# Altium schematic sheet AIR Control Relays.SchDoc
size A4
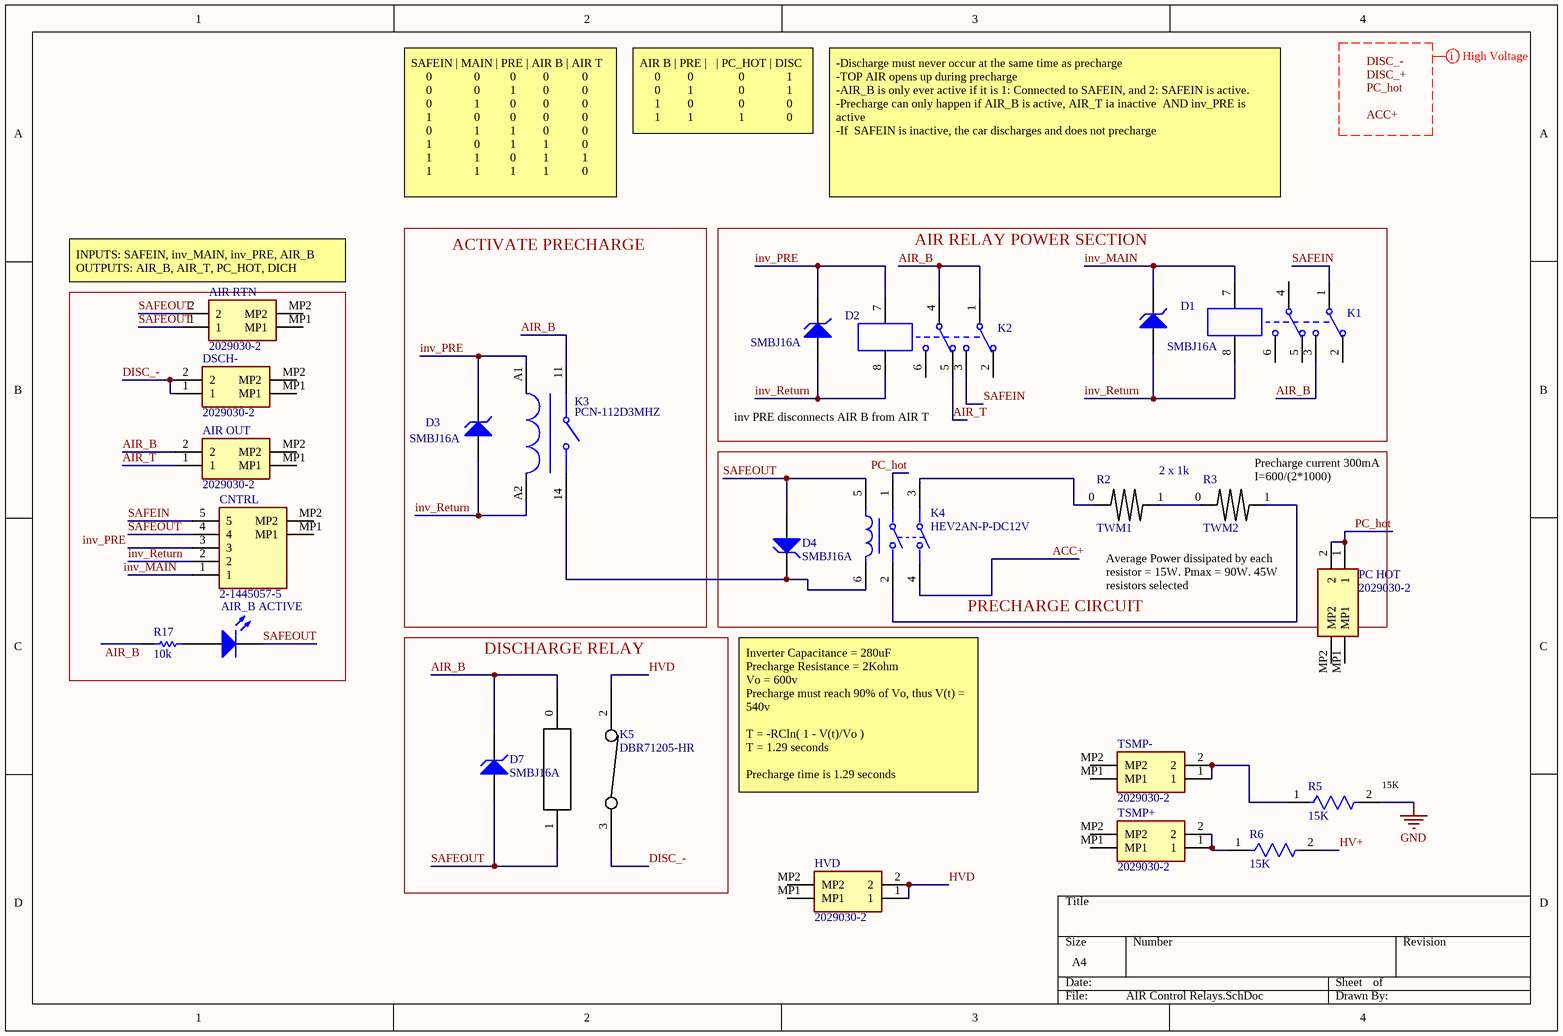
[diagram p0: AIR Control Relays.SchDoc]

## Parts
AIR_B_ACTIVE  HSMS-C177  [Led 0805/2012]  (value not drawn)
AIR_OUT  2029030-2  [20290302]
AIR_RTN  2029030-2  [20290302]
CNTRL  2-1445057-5  [214450575]
D1  SMBJ16A  [DO-214AA]
D2  SMBJ16A  [DO-214AA]
D3  SMBJ16A  [DO-214AA]
D4  SMBJ16A  [DO-214AA]
D7  SMBJ16A  [DO-214AA]
DSCH-  2029030-2  [20290302]
HVD  2029030-2  [20290302]
K1  Relay-DPDT  [S4190D]  (value not drawn)
K2  Relay-DPDT  [S4190D]  (value not drawn)
K3  PCN-112D3MHZ  [PCN-112D3MHZ]
K4  HEV2AN-P-DC12V  [FP-HE-V-MFG]
K5  DBR71205-HR  [RelaySPSTNC]
PC_HOT  2029030-2  [20290302]
R2  TWM1  [TWM20]
R3  TWM2  [TWM20]
R5  15K  [FP-SMF5-MFG]
R6  15K  [FP-SMF5-MFG]
R17  value 10k  [RES 0603/1608]  (hidden comment: RT0603BRC0710KL)
TSMP+  2029030-2  [20290302]
TSMP-  2029030-2  [20290302]

## Blocks framed on the sheet
ACTIVATE PRECHARGE: D3 K3
AIR RELAY POWER SECTION: D1 D2 K1 K2
PRECHARGE CIRCUIT: D4 K4 PC_HOT R2 R3
DISCHARGE RELAY: D7 K5

## Nets
GND: R5.2
ACC+: K4.4
AIR_B: AIR_OUT.2 D7.2(K) K1.3 K2.1 K2.4 K3.11 K5.0 R17.1
AIR_T: AIR_OUT.1 K2.5
DISC_-: DSCH-.1 DSCH-.2 K5.3
HV+: R6.2
HVD: HVD.1 HVD.2 K5.2
inv_MAIN: CNTRL.1 D1.2(K) K1.7
inv_PRE: CNTRL.3 D2.2(K) D3.2(K) K2.7 K3.A1
inv_Return: CNTRL.2 D1.1(A) D2.1(A) D3.1(A) K1.8 K2.8 K3.A2
PC_hot: K4.1 PC_HOT.1 PC_HOT.2
SAFEIN: CNTRL.5 K1.1 K2.3
SAFEOUT: AIR_B_ACTIVE.2(K) AIR_RTN.1 AIR_RTN.2 CNTRL.4 D4.1(A) D7.1(A) K4.5 K5.1
NetAIR_B_ACTIVE_1: AIR_B_ACTIVE.1(A) R17.2
NetD4_2: D4.2(K) K3.14 K4.6
NetK4_2: K4.2 R3.1
NetK4_3: K4.3 R2.0
NetR2_1: R2.1 R3.0
NetR5_1: R5.1 TSMP-.1 TSMP-.2
NetR6_1: R6.1 TSMP+.1 TSMP+.2

Not connected (* = marked no-connect by the designer): AIR_OUT MP1 MP2; AIR_RTN MP1 MP2; CNTRL MP1 MP2; DSCH- MP1 MP2; HVD MP1 MP2; K1 2 4 5 6; K2 2 6; PC_HOT MP1 MP2; TSMP+ MP1 MP2; TSMP- MP1 MP2

## Layout directives
net class High Voltage: ACC+, DISC_+, DISC_-, PC_hot

## Notes on the sheet
- AIR B | PRE |   | PC_HOT | DISC
  0         0               0              1
  0         1               0              1
  1         0               0              0
  1         1               1              0
- SAFEIN | MAIN | PRE | AIR B | AIR T
  0              0          0         0           0
  0              0          1         0           0
  0              1          0         0           0
  1              0          0         0           0
  0              1          1         0           0
  1              0          1         1           0
  1              1          0         1           1
  1              1          1         1           0
- -Discharge must never occur at the same time as precharge
  -TOP AIR opens up during precharge
  -AIR_B is only ever active if it is 1: Connected to SAFEIN, and 2: SAFEIN is active.
  -Precharge can only happen if AIR_B is active, AIR_T ia inactive  AND inv_PRE is active
  -If  SAFEIN is inactive, the car discharges and does not precharge
- (near AIR_RTN) INPUTS: SAFEIN, inv_MAIN, inv_PRE, AIR_B
  OUTPUTS: AIR_B, AIR_T, PC_HOT, DICH
- inv PRE disconnects AIR B from AIR T
- 2 x 1k
- (near R3) Precharge current 300mA I=600/(2*1000)
- Average Power dissipated by each resistor = 15W. Pmax = 90W. 45W resistors selected
- Inverter Capacitance = 280uF
  Precharge Resistance = 2Kohm
  Vo = 600v
  Precharge must reach 90% of Vo, thus V(t) = 540v
  T = -RCln( 1 - V(t)/Vo )
  T = 1.29 seconds
  Precharge time is 1.29 seconds
- (near R5) 15K
- Labels drawn without touching a wire or pin: ACC+, DISC_+, DISC_-, PC_hot

## Library data of the parts
AIR_B_ACTIVE = LED2: Standard LEDs - SMD Chip Top Mt HER; Published: 8-Jun-2000; LatestRevisionDate: 17-Jul-2002; LatestRevisionNote: Re-released for DXP Platform.; PackageVersion: Feb-2002; PackageReference: 3.2X1.6X1.1; Publisher: Altium Limited; PackageDescription: SM LED; 2 Flat Leads
AIR_OUT AIR_RTN DSCH- HVD PC_HOT TSMP+ TSMP- = 2029030-2: Connector; Manufacturer_Name: TE Connectivity; Datasheet Link: https://datasheet.datasheetarchive.com/originals/distributors/Datasheets_SAMA/f75355dc101dbac16187fb02437cb13d.pdf; Height: 4.37mm; Manufacturer_Part_Number: 2029030-2
CNTRL = 2-1445057-5: Connector; Manufacturer_Name: TE Connectivity; Datasheet Link: https://componentsearchengine.com/Datasheets/1/2-1445057-5.pdf; Height: 5.67mm; Manufacturer_Part_Number: 2-1445057-5
D1-D4 D7 = D Zener: 714-7162; Published: 8-Jun-2000; LatestRevisionDate: 17-Jul-2002; LatestRevisionNote: Re-released for DXP Platform.; PackageReference: DIODE-0.7; Publisher: Altium Limited; PackageDescription: Diode, Thru-Hole; 2 Leads; 0.7 in Pin Spacing
K1 K2 = Relay-DPDT: Dual-Pole Dual-Throw Relay; pin to pad: 1>2 2>3 3>1 4>7 5>6 6>8 7>4 8>5; Published: 24-Mar-1999; LatestRevisionDate: 17-Jul-2002; LatestRevisionNote: Re-released for DXP Platform.; PackageReference: DIP-P8; Publisher: Altium Limited; PackageDescription: Relay; 8 Leads
K3 = PCN-112D3MHZ: Relay
K4 = CMP-05606-000003-1: RELAY GEN PURPOSE DPST 20A 24V; Manufacturer Part Number: HEV2AN-P-DC24V; Manufacturer: Panasonic Electric Works; Coil Type: Non-Latching; Throw Configuration: DPST-NO (2 Form A); Number Of Contacts: 2; Coil Current: 80mA; Coil Power: 1920mW; Coil Resistance: 300Ω; Digikey Description: RELAY GEN PURPOSE DPST 20A 24V; Device Class L1: Electromechanical; Current Rating: 20A; Mouser Description: General Purpose Relays HE-V 20A High Capacity DC24V; Package: HE-V; Device Class L2: Relays; Temperature Range High: +85°C; Temperature Range Low: -40°C; ComponentLink2Description: Datasheet; Switching Current: 20A; Temperature: -40°C to +85°C; Automotive: No; ComponentLink2URL: https://industrial.panasonic.com/ac/cdn/e/control/relay/interception/catalog/mech_eng_hev.pdf; Category: Relay; Device Class L3: Power Relays; Lead Free: Yes; Coil Voltage: 24V; Octopart: https://octopart.com/hev2an-p-dc24v-panasonic-45743145; Height: 39.7mm; RoHS: TRUE
K5 = DBR71205-HR: SPST NC Reed Relay
R2 R3 = Component_1: https://www.ohmite.com/assets/docs/res_tww_twm.pdf
R5 R6 = CMP-03211-011405-1: SMF715KJT; Voltage Rating: 500V; Resistance: 1kR; Tolerance: 5%; Max Power Dissipation: 5W; Number of Resistors: 1; Temperature Coefficient: 100ppm/°C; Number of Terminations: 2; Depth: 7.3mm; Packaging: Tape and Reel; Case/Package: SMD/SMT; RoHS Compliant: Yes; Resistor Type: Power resistor; Features: Flame Retardant Coating; Max Operating Temperature: 280°C; Min Operating Temperature: -80°C; Mount: Surface Mount; Series: SM; Resistance Tolerance: 5%; Height: 6.8mm; Width: 7.3mm; Technology: METAL FILM; Power Rating: 5W; Case Code (Imperial): 5328; ELV: Compliant; Radiation Hardening: No; Voltage Rating (DC): 500V; Length: 13.5mm; Termination: Solder
R17 = Res1: Thin Film Resistors - SMD 10K OHM .1% 15PPM 1/10W; Published: 8-Jun-2000; LatestRevisionDate: 17-Jul-2002; LatestRevisionNote: Re-released for DXP Platform.; PackageReference: AXIAL-0.3; Publisher: Altium Limited; PackageDescription: Axial Device, Thru-Hole; 2 Leads; 0.3 in Pin Spacing